# Altium schematic sheet STM32F303RET6.SchDoc
size A4; Author: Alexander Cote; DrawnBy: Alexander Cote; Engineer: Alexander Cote; DocumentNumber: 5; Revision: 1.0; SheetNumber: 5; SheetTotal: 5
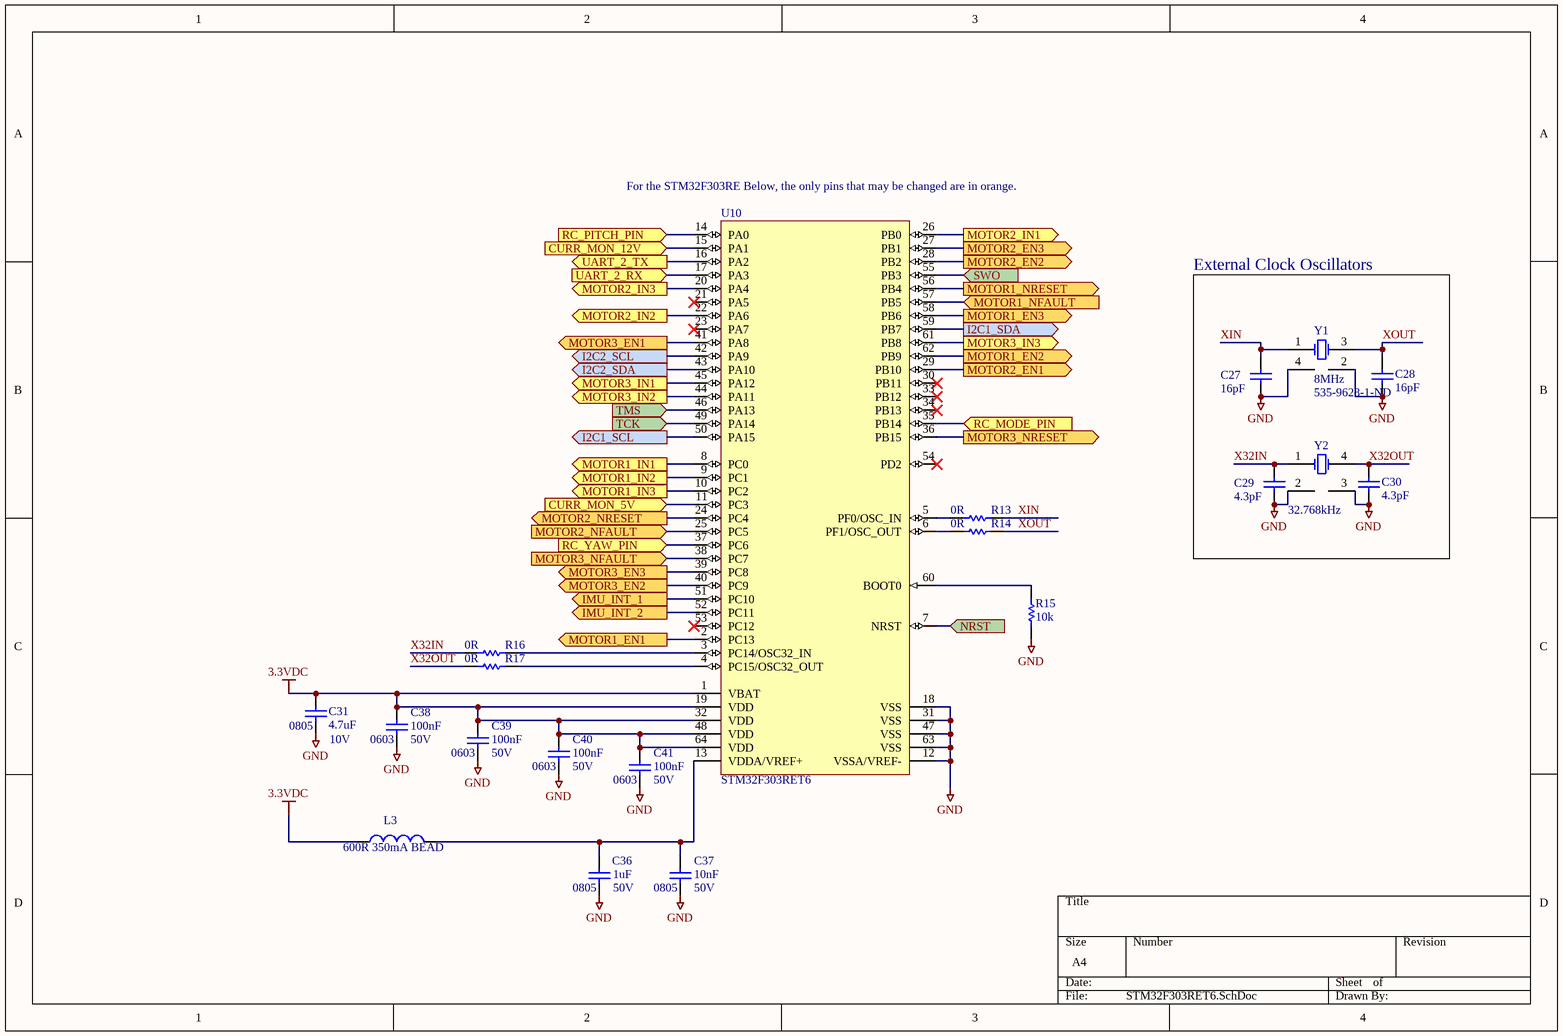
[diagram p0: STM32F303RET6.SchDoc]

## Parts
C27  16pF  [CAPC1608N(0603")]
C28  16pF  [CAPC1608N(0603")]
C29  4.3pF  [CAPC1608N(0603")]
C30  4.3pF  [CAPC1608N(0603")]
C31  4.7uF  Case/Package: 0805  Voltage Rating (DC): 10V  [CAPC2012N(0805")]
C36  Voltage Rating: 50V  Case/Package: 0805  Capacitance: 1uF  [CAPC2012N(0805")]  (hidden comment: CL21A105KBCLNNC)
C37  10nF  Case/Package: 0805  Voltage Rating: 50V  [CAPC2012N(0805")]
C38  100nF  Case Code (Imperial): 0603  Voltage Rating: 50V  [CAPC1608N(0603")]
C39  100nF  Case Code (Imperial): 0603  Voltage Rating: 50V  [CAPC1608N(0603")]
C40  100nF  Case Code (Imperial): 0603  Voltage Rating: 50V  [CAPC1608N(0603")]
C41  100nF  Case Code (Imperial): 0603  Voltage Rating: 50V  [CAPC1608N(0603")]
L3  600R 350mA BEAD  [RESC1608N(0603")]
R13  0R  [RESC1608N(0603")]
R14  0R  [RESC1608N(0603")]
R15  Resistance: 10k  [RESC2012N(0805")]  (hidden comment: CRCW080510K0FKEA)
R16  0R  [RESC1608N(0603")]
R17  0R  [RESC1608N(0603")]
U10  STM32F303RET6  [STM-LQFP64_M]
Y1  8MHz  Supplier Part Number 1: 535-9628-1-ND  [CRYSTAL 4-SMD, 3.60x6.00mm]
Y2  32.768kHz  [SOJ550P380X260-4M]

## Blocks framed on the sheet
External Clock Oscillators: C27-C30 Y1 Y2

## Ports
CURR_MON_5V (in), CURR_MON_12V (in), I2C1_SCL (out), I2C1_SDA (out), I2C2_SCL (out), I2C2_SDA (out), IMU_INT_1 (out), IMU_INT_2 (out), MOTOR1_EN1 (out), MOTOR1_EN2 (out), MOTOR1_EN3 (out), MOTOR1_IN1 (out), MOTOR1_IN2 (out), MOTOR1_IN3 (out), MOTOR1_NFAULT (in), MOTOR1_NRESET (out), MOTOR2_EN1 (out), MOTOR2_EN2 (out), MOTOR2_EN3 (out), MOTOR2_IN1 (out), MOTOR2_IN2 (out), MOTOR2_IN3 (out), MOTOR2_NFAULT (in), MOTOR2_NRESET (out), MOTOR3_EN1 (out), MOTOR3_EN2 (out), MOTOR3_EN3 (out), MOTOR3_IN1 (out), MOTOR3_IN2 (out), MOTOR3_IN3 (out), MOTOR3_NFAULT (in), MOTOR3_NRESET (out), NRST (in), RC_MODE_PIN (in), RC_PITCH_PIN (in), RC_YAW_PIN (in), SWO (in), TCK (in), TMS (in), UART_2_RX (in), UART_2_TX (out)

## Nets
3.3VDC: C31.2 C38.2 C39.2 C40.2 C41.2 L3.1 U10.1(VBAT) U10.19(VDD) U10.32(VDD) U10.48(VDD) U10.64(VDD)
GND: C27.1 C28.1 C29.1 C30.1 C31.1 C36.1 C37.1 C38.1 C39.1 C40.1 C41.1 R15.1 U10.12(VSSA/VREF-) U10.18(VSS) U10.31(VSS) U10.47(VSS) U10.63(VSS) Y1.2(OSC1) Y1.4(OSC1) Y2.2(GND) Y2.3(GND)
CURR_MON_5V: U10.11(PC3) ; port CURR_MON_5V
CURR_MON_12V: U10.15(PA1) ; port CURR_MON_12V
I2C1_SCL: U10.50(PA15) ; port I2C1_SCL
I2C1_SDA: U10.59(PB7) ; port I2C1_SDA
I2C2_SCL: U10.42(PA9) ; port I2C2_SCL
I2C2_SDA: U10.43(PA10) ; port I2C2_SDA
IMU_INT_1: U10.51(PC10) ; port IMU_INT_1
IMU_INT_2: U10.52(PC11) ; port IMU_INT_2
MOTOR1_EN1: U10.2(PC13) ; port MOTOR1_EN1
MOTOR1_EN2: U10.62(PB9) ; port MOTOR1_EN2
MOTOR1_EN3: U10.58(PB6) ; port MOTOR1_EN3
MOTOR1_IN1: U10.8(PC0) ; port MOTOR1_IN1
MOTOR1_IN2: U10.9(PC1) ; port MOTOR1_IN2
MOTOR1_IN3: U10.10(PC2) ; port MOTOR1_IN3
MOTOR1_NFAULT: U10.57(PB5) ; port MOTOR1_NFAULT
MOTOR1_NRESET: U10.56(PB4) ; port MOTOR1_NRESET
MOTOR2_EN1: U10.29(PB10) ; port MOTOR2_EN1
MOTOR2_EN2: U10.28(PB2) ; port MOTOR2_EN2
MOTOR2_EN3: U10.27(PB1) ; port MOTOR2_EN3
MOTOR2_IN1: U10.26(PB0) ; port MOTOR2_IN1
MOTOR2_IN2: U10.22(PA6) ; port MOTOR2_IN2
MOTOR2_IN3: U10.20(PA4) ; port MOTOR2_IN3
MOTOR2_NFAULT: U10.25(PC5) ; port MOTOR2_NFAULT
MOTOR2_NRESET: U10.24(PC4) ; port MOTOR2_NRESET
MOTOR3_EN1: U10.41(PA8) ; port MOTOR3_EN1
MOTOR3_EN2: U10.40(PC9) ; port MOTOR3_EN2
MOTOR3_EN3: U10.39(PC8) ; port MOTOR3_EN3
MOTOR3_IN1: U10.45(PA12) ; port MOTOR3_IN1
MOTOR3_IN2: U10.44(PA11) ; port MOTOR3_IN2
MOTOR3_IN3: U10.61(PB8) ; port MOTOR3_IN3
MOTOR3_NFAULT: U10.38(PC7) ; port MOTOR3_NFAULT
MOTOR3_NRESET: U10.36(PB15) ; port MOTOR3_NRESET
NRST: U10.7(NRST) ; port NRST
RC_MODE_PIN: U10.35(PB14) ; port RC_MODE_PIN
RC_PITCH_PIN: U10.14(PA0) ; port RC_PITCH_PIN
RC_YAW_PIN: U10.37(PC6) ; port RC_YAW_PIN
SWO: U10.55(PB3) ; port SWO
TCK: U10.49(PA14) ; port TCK
TMS: U10.46(PA13) ; port TMS
UART_2_RX: U10.17(PA3) ; port UART_2_RX
UART_2_TX: U10.16(PA2) ; port UART_2_TX
X32IN: C29.2 R16.1 Y2.1(OSC1)
X32OUT: C30.2 R17.1 Y2.4(OSC2)
XIN: C27.2 R13.2 Y1.1(OSC1)
XOUT: C28.2 R14.2 Y1.3(OSC2)
NetC36_2: C36.2 C37.2 L3.2 U10.13(VDDA/VREF+)
NetR13_1: R13.1 U10.5(PF0/OSC_IN)
NetR14_1: R14.1 U10.6(PF1/OSC_OUT)
NetR15_2: R15.2 U10.60(BOOT0)
NetR16_2: R16.2 U10.3(PC14/OSC32_IN)
NetR17_2: R17.2 U10.4(PC15/OSC32_OUT)

Not connected (* = marked no-connect by the designer): U10 21(PA5)* 23(PA7)* 30(PB11)* 33(PB12)* 34(PB13)* 53(PC12)* 54(PD2)*

## Notes on the sheet
- (near U10) For the STM32F303RE Below, the only pins that may be changed are in orange.

## Library data of the parts
C27 C28 = 16pF, 50V, 0603, SMD, Ceramic: Capacitor, Ceramic, 50V, +/- 5%, 0603, SMD, C0G/NP0; Mfg#: CL10C160JB8NNNC; Mfg: Samsung Electro-Mechanics America, Inc; Published: November 2, 2013; Publisher: UVic AERO, Luke Mills; PackageDescription: Chip Capacitor; Value: 16pF; Supplier 1: Digi-Key; Verified: no; Voltage: 50V; Supplier Part Number 1: 1276-2204-1-ND
C29 C30 = 4.3pF 50V 0603 SMD, Ceramic: Capacitor, Ceramic, 50V, +/- 0.1pF, 0603 SMD, C0G, NP0; Mfg#: CL10C4R3BB8NNNC; Mfg: Samsung Electro-Mechanics; Published: 2017-11-22; Publisher: UVic AERO, Taylor Long; PackageDescription: Chip Capacitor; Value: 4.3pF; Supplier 1: Digi-Key; Supplier Part Number 1: 1276-2308-1-ND
C31 = C0805C475K8PACTU: CAP CER 4.7UF 10V, +/- 10%, 0805 SMD, X7R; Manufacturer: KEMET; Dielectric Material: Ceramic; Dielectric: X5R; Published: April 29, 2010; LatestRevisionDate: April 29, 2010; Publisher: TRAXX Automation Ltd.; PackageDescription: Chip Capacitor; Value: 4.7uF; Supplier 1: Digi-Key; Supplier Part Number 1: 399-3133-1-ND; Manufacturer Part Number: C0805C475K8PACTU; Stock 1: 393227; Pricing 1: 1 = 0.29000, 10 = 0.19500, 100 = 0.09860, 500 = 0.06746, 1000 = 0.05967 (USD); RoHS: Yes; Mount: Surface Mount; Min Operating Temperature: -55°C; Max Operating Temperature: 85°C; Tolerance: 10%; Packaging: Tape and Reel; Capacitance: 4.7uF; Length: 2mm; Height: 1.25mm; Depth: 1.25mm; Radiation Hardening: No; Lead Free: Lead Free; ComponentLink1URL: https://datasheet.ciiva.com/18193/getdatasheetpartid-179373-18193909.pdf?src-supplier=Verical; ComponentLink1Description: https://datasheet.ciiva.com/18193/getdatasheetpartid-179373-18193909.pdf?src-supplier=Verical; ComponentLink2URL: https://datasheet.ciiva.com/6126/40889-6126699.pdf?src-supplier=Farnell; ComponentLink2Description: https://datasheet.ciiva.com/6126/40889-6126699.pdf?src-supplier=Farnell; ComponentLink3URL: https://datasheet.ciiva.com/28614/1918694-28614763.pdf?src-supplier=Element14; ComponentLink3Description: https://datasheet.ciiva.com/28614/1918694-28614763.pdf?src-supplier=Element14; ComponentLink4URL: https://datasheet.ciiva.com/7842/40889-7842616.pdf?src-supplier=Element14; ComponentLink4Description: https://datasheet.ciiva.com/7842/40889-7842616.pdf?src-supplier=Element14; ComponentLink5URL: https://datasheet.ciiva.com/46385/1791935-46385676.pdf?src-supplier=Element14; ComponentLink5Description: https://datasheet.ciiva.com/46385/1791935-46385676.pdf?src-supplier=Element14
C36 = CL21A105KBCLNNC: CAP CER 1uF 50V X5R 10% SMD 0805 85C Cardboard T/R; Manufacturer: Samsung; Supplier 1: Digi-Key; Manufacturer Part Number: CL21A105KBCLNNC; Stock 1: 343658; Pricing 1: 1 = 0.17000, 10 = 0.11400, 100 = 0.05780, 500 = 0.03954, 1000 = 0.03498 (USD); RoHS: Yes; Mount: Surface Mount; Case Code (Metric): 2012; Case Code (Imperial): 0805; Min Operating Temperature: -55°C; Max Operating Temperature: 85°C; Tolerance: 10%; Package Quantity: 1; Packaging: Tape and Reel; Dielectric: X5R; Length: 2mm; Height: 0.85mm; Width: 0.049inch; Depth: 1.25mm; Thickness: 0.037inch; Radiation Hardening: No; Lead Free: Lead Free; ComponentLink1URL: https://datasheet.ciiva.com/25775/cl21a105kbclnnc-25775425.pdf?src-supplier=Digi-Key; ComponentLink1Description: https://datasheet.ciiva.com/25775/cl21a105kbclnnc-25775425.pdf?src-supplier=Digi-Key; Supplier Part Number 1: 1276-2396-1-ND
C37 = C0805C103K5RACTU: CAP CER 10nF 50V, +/- 10%, 0805 SMD, X7R C0805C103K5RACTU; Manufacturer: KEMET; Dielectric Material: Ceramic; Published: August 31, 2013; Publisher: UVic AERO; PackageDescription: Chip Capacitor; Value: 10nF; Supplier 1: Digi-Key; Supplier Part Number 1: 399-1158-1-ND; Supplier 2: Allied Electronics; Manufacturer Part Number: C0805C103K5RACTU; Stock 2: 0; RoHS: Yes; Mount: Surface Mount; Number of Pins: 2; Case Code (Metric): 2012; Case Code (Imperial): 0805; Min Operating Temperature: -55°C; Max Operating Temperature: 125°C; Voltage Rating (DC): 50V; Capacitance: 10nF; Tolerance: 10%; Packaging: Tape and Reel; Dielectric: X7R; Package Quantity: 1; Termination: SMD/SMT; Length: 2mm; Height: 0.78mm; Width: 0.049inch; Lead Pitch: 0.75mm; Depth: 1.25mm; Thickness: 0.035inch; Radiation Hardening: No; REACH SVHC: No SVHC; ComponentLink1URL: https://datasheet.ciiva.com/5904/kem-c1002-x7r-smd-5904709.pdf?src-supplier=Farnell; ComponentLink1Description: https://datasheet.ciiva.com/5904/kem-c1002-x7r-smd-5904709.pdf?src-supplier=Farnell; ComponentLink2URL: https://datasheet.ciiva.com/28672/1851736-28672830.pdf?src-supplier=Element14; ComponentLink2Description: https://datasheet.ciiva.com/28672/1851736-28672830.pdf?src-supplier=Element14; ComponentLink3URL: https://datasheet.ciiva.com/7842/kem-c1002-x7r-smd-7842533.pdf?src-supplier=Element14; ComponentLink3Description: https://datasheet.ciiva.com/7842/kem-c1002-x7r-smd-7842533.pdf?src-supplier=Element14; ComponentLink4URL: https://datasheet.ciiva.com/26923/getdatasheetpartid-759674-26923957.pdf?src-supplier=Verical; ComponentLink4Description: https://datasheet.ciiva.com/26923/getdatasheetpartid-759674-26923957.pdf?src-supplier=Verical; ComponentLink5URL: https://datasheet.ciiva.com/39122/docfinderpartnumberc0402c102k5ractu-39122923.pdf?src-supplier=Onlinecomponents.com; ComponentLink5Description: https://datasheet.ciiva.com/39122/docfinderpartnumberc0402c102k5ractu-39122923.pdf?src-supplier=Onlinecomponents.com; ComponentLink6URL: https://datasheet.ciiva.com/7172/1828800-7172412.pdf?src-supplier=Newark; ComponentLink6Description: https://datasheet.ciiva.com/7172/1828800-7172412.pdf?src-supplier=Newark; Supplier Part Number 2: 70095550
C38-C41 = CL10B104KB8SFNC: CAP CER 0.1UF 50V X7R 0603; Manufacturer: Samsung; Tolerance: 10%; Supplier 1: Digi-Key; Manufacturer Part Number: CL10B104KB8SFNC; Stock 1: 1859763; Pricing 1: 1 = 0.10000, 10 = 0.02900, 100 = 0.01300, 500 = 0.00928, 1000 = 0.00729 (USD); RoHS: Yes; Mount: Surface Mount; Case/Package: 0603; Case Code (Metric): 1608; Contact Plating: Tin; Min Operating Temperature: -55°C; Max Operating Temperature: 125°C; Package Quantity: 4000; Packaging: Tape and Reel; Capacitance: 100nF; Dielectric: X7R; Features: Soft Termination; Length: 1.6mm; Height: 0.8mm; Width: 0.031inch; Thickness: 0.035inch; Depth: 0.8mm; Radiation Hardening: No; Lead Free: Lead Free; ComponentLink1URL: https://datasheet.ciiva.com/25714/cl10b104kb8sfnc-25714514.pdf?src-supplier=Digi-Key; ComponentLink1Description: https://datasheet.ciiva.com/25714/cl10b104kb8sfnc-25714514.pdf?src-supplier=Digi-Key; Supplier Part Number 1: 1276-1936-1-ND
L3 = BK1608HS601-T: FERRITE BEAD 600 OHM 0603 1LN; Manufacturer: Taiyo Yuden; Tolerance: 25%; DC Resistance (DCR): 450mR; Test Frequency: 100MHz; Number of Lines: 1; Shielding: Shielded; Supplier 1: Digi-Key; Manufacturer Part Number: BK1608HS601-T; Stock 1: 27923; Pricing 1: 1 = 0.10000, 10 = 0.07900, 25 = 0.07200, 50 = 0.06480, 100 = 0.04760, 250 = 0.03460, 500 = 0.03170, 1000 = 0.02738 (USD); RoHS: Yes; Mount: Surface Mount; Case/Package: 0603; Number of Pins: 2; Core Material: Ferrite; Case Code (Metric): 1608; Case Code (Imperial): 0603; Min Operating Temperature: -55°C; Max Operating Temperature: 125°C; Packaging: Tape and Reel; Package Quantity: 1; Impedance: 600R; Max DC Current: 350mA; Termination: SMD/SMT; Max Current Rating: 350mA; Frequency: 100MHz; Length: 0.063inch; Height: 0.95mm; Width: 0.031inch; Depth: 0.95mm; Lead Free: Lead Free; Halogen Free: Halogen Free; REACH SVHC: Unknown; ComponentLink1URL: https://datasheet.ciiva.com/1011/bk1608hs601-t-ss-1011856.pdf?src-supplier=Digi-Key; ComponentLink1Description: https://datasheet.ciiva.com/1011/bk1608hs601-t-ss-1011856.pdf?src-supplier=Digi-Key; ComponentLink2URL: https://datasheet.ciiva.com/30231/126bk1608hs601-t-30231402.pdf?src-supplier=Onlinecomponents.com; ComponentLink2Description: https://datasheet.ciiva.com/30231/126bk1608hs601-t-30231402.pdf?src-supplier=Onlinecomponents.com; ComponentLink3URL: https://datasheet.ciiva.com/16000/bk1608hs601-t1-16000876.pdf?src-supplier=Onlinecomponents.com; ComponentLink3Description: https://datasheet.ciiva.com/16000/bk1608hs601-t1-16000876.pdf?src-supplier=Onlinecomponents.com; ComponentLink4URL: https://datasheet.ciiva.com/1011/mlci07-e-1011857.pdf?src-supplier=Digi-Key; ComponentLink4Description: https://datasheet.ciiva.com/1011/mlci07-e-1011857.pdf?src-supplier=Digi-Key; ComponentLink5URL: https://datasheet.ciiva.com/1011/mlci07-e-1011855.pdf?src-supplier=Digi-Key; ComponentLink5Description: https://datasheet.ciiva.com/1011/mlci07-e-1011855.pdf?src-supplier=Digi-Key; Supplier Part Number 1: 587-1874-1-ND
R13 R14 R16 R17 = 0R, 1/10 W, 0603 SMD: Resistor, 0R, 1/10 W, 0603 SMD, 0R, +/-200ppm/C, Thick Film; Power: 1/10W; Published: Jan 14, 2011; Publisher: TRAXX Automation Ltd.; PackageDescription: Chip Resistor; Value: 0R; Supplier 1: Digi-Key; Supplier Part Number 1: 311-0.0GRCT-ND
R15 = CRCW080510K0FKEA: RES SMD 10K OHM 1% 1/8W 0805; Manufacturer: Vishay; Temperature Coefficient: 100ppm/°C; Power Rating: 125mW; Voltage Rating: 150V; Supplier 1: Digi-Key; Manufacturer Part Number: CRCW080510K0FKEA; Stock 1: 374664; Pricing 1: 1 = 0.10000, 10 = 0.06600, 100 = 0.02670, 1000 = 0.01199, 2500 = 0.01041 (USD); RoHS: Yes; Case/Package: 0805; Weight: 0.000194oz; Contact Plating: Tin; Case Code (Imperial): 0805; Case Code (Metric): 2012; Min Operating Temperature: -55°C; Max Operating Temperature: 155°C; Tolerance: 1%; Composition: Thick Film; Packaging: Tape and Reel; Package Quantity: 5000; Military Standard: Not; Termination: SMD/SMT; Voltage Rating (DC): 150V; Length: 2mm; Height: 0.45mm; Width: 1.25mm; Depth: 1.25mm; Radiation Hardening: No; Lead Free: Lead Free; REACH SVHC: Unknown; ComponentLink1URL: https://datasheet.ciiva.com/11808/0900766b80d98b26-11808216.pdf?src-supplier=RSComponents; ComponentLink1Description: https://datasheet.ciiva.com/11808/0900766b80d98b26-11808216.pdf?src-supplier=RSComponents; ComponentLink2URL: https://datasheet.ciiva.com/16514/dcrcwe3-16514907.pdf?src-supplier=Avnet+Asia; ComponentLink2Description: https://datasheet.ciiva.com/16514/dcrcwe3-16514907.pdf?src-supplier=Avnet+Asia; ComponentLink3URL: https://datasheet.ciiva.com/16883/dcrcwe3-16883708.pdf?src-supplier=Avnet+Europe; ComponentLink3Description: https://datasheet.ciiva.com/16883/dcrcwe3-16883708.pdf?src-supplier=Avnet+Europe; ComponentLink4URL: https://datasheet.ciiva.com/8337/dcrcwe3-8337773.pdf?src-supplier=Avnet; ComponentLink4Description: https://datasheet.ciiva.com/8337/dcrcwe3-8337773.pdf?src-supplier=Avnet; ComponentLink5URL: https://datasheet.ciiva.com/16755/70201119-16755389.pdf?src-supplier=Allied+Electronics; ComponentLink5Description: https://datasheet.ciiva.com/16755/70201119-16755389.pdf?src-supplier=Allied+Electronics; ComponentLink6URL: https://datasheet.ciiva.com/46394/1720486-46394381.pdf?src-supplier=Element14; ComponentLink6Description: https://datasheet.ciiva.com/46394/1720486-46394381.pdf?src-supplier=Element14; ComponentLink7URL: https://datasheet.ciiva.com/8337/dcrcwe3-8337774.pdf?src-supplier=Avnet; ComponentLink7Description: https://datasheet.ciiva.com/8337/dcrcwe3-8337774.pdf?src-supplier=Avnet; ComponentLink8URL: https://datasheet.ciiva.com/16199/dcrcwe3-16199086.pdf?src-supplier=Future+Electronics; ComponentLink8Description: https://datasheet.ciiva.com/16199/dcrcwe3-16199086.pdf?src-supplier=Future+Electronics; ComponentLink9URL: https://datasheet.ciiva.com/5547/dcrcwe3-109170-5547559.pdf?src-supplier=Mouser; ComponentLink9Description: https://datasheet.ciiva.com/5547/dcrcwe3-109170-5547559.pdf?src-supplier=Mouser; ComponentLink10URL: https://datasheet.ciiva.com/16719/70201119-16719082.pdf?src-supplier=Allied+Electronics; ComponentLink10Description: https://datasheet.ciiva.com/16719/70201119-16719082.pdf?src-supplier=Allied+Electronics; Supplier Part Number 1: 541-10.0KCCT-ND
U10 = CMP-0537-00048-1: ARM Cortex-M4 32-bit MCU, 512 KB Flash, 80 KB Internal RAM, 51 I/Os, 64-Pin LQFP, -40 to 85 degC, Tray; Operating Frequency(F) (Processor speed) (MHz): 72; FLASH Size (Prog) (kB): 512; Internal RAM Size (kB): 80; I/Os (High Current): 51; D/A Converter: 2; ComponentLink2Description: Datasheet; ComponentLink1URL: http://www.st.com/; ComponentLink1Description: Manufacturer URL; Package Description: 64-Pin Low-profile Quad Flat Package, Body 10 x 10 mm, Pitch 0.5 mm; Package Reference: LQFP64; Mounting Technology: Surface Mount; Packing: Tray; Core: ARM Cortex-M4; ComponentLink2URL: http://www.st.com/st-web-ui/static/active/en/resource/technical/document/datasheet/DM00118585.pdf; DatasheetVersion: Rev. 5; Supply Voltage(Vcc) min (V): 2
Y1 = Crystal 8MHz, 18pF, 4-SMD 6.0x3.6mm: Crystal Oscillator 8MHz, 18pF, 4-SMD; Published: March 24, 2011; Publisher: UVic AERO, Taylor Long; Value: 8MHz; Supplier 1: Digi-Key
Y2 = Crystal 32.768khz, 4-SOJ 5.5mm: Crystal Oscillator 32.768kHz, 4-SOJ 5.5mm; Loaded Capacitance: 6pF; Published: 2017-11-22; Publisher: UVic AERO. Taylor Long; Supplier 1: Digi-Key; Verified: no; Supplier Part Number 1: XC1307CT-ND; Value: 32.768kHz